# Altium schematic sheet tps61202.SchDoc
size A4; SheetNumber: 3; SheetTotal: 7
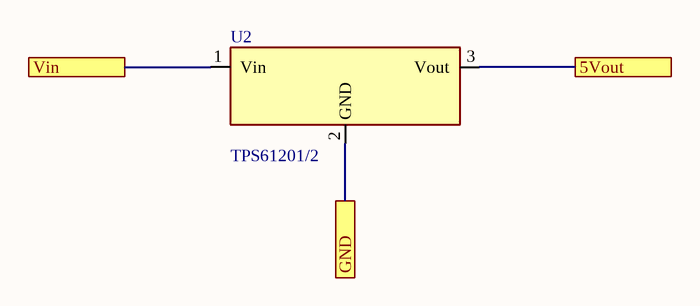
[diagram p0: tps61202.SchDoc]

## Parts
U2  TPS61201/2  [tps61201_2]

## Ports
5Vout, GND, Vin

## Nets
5Vout: U2.3(Vout) ; port 5Vout
GND: U2.2(GND) ; port GND
Vin: U2.1(Vin) ; port Vin

## Library data of the parts
U2 = TPS61201/2: DigiKey: TPS61202DRCR